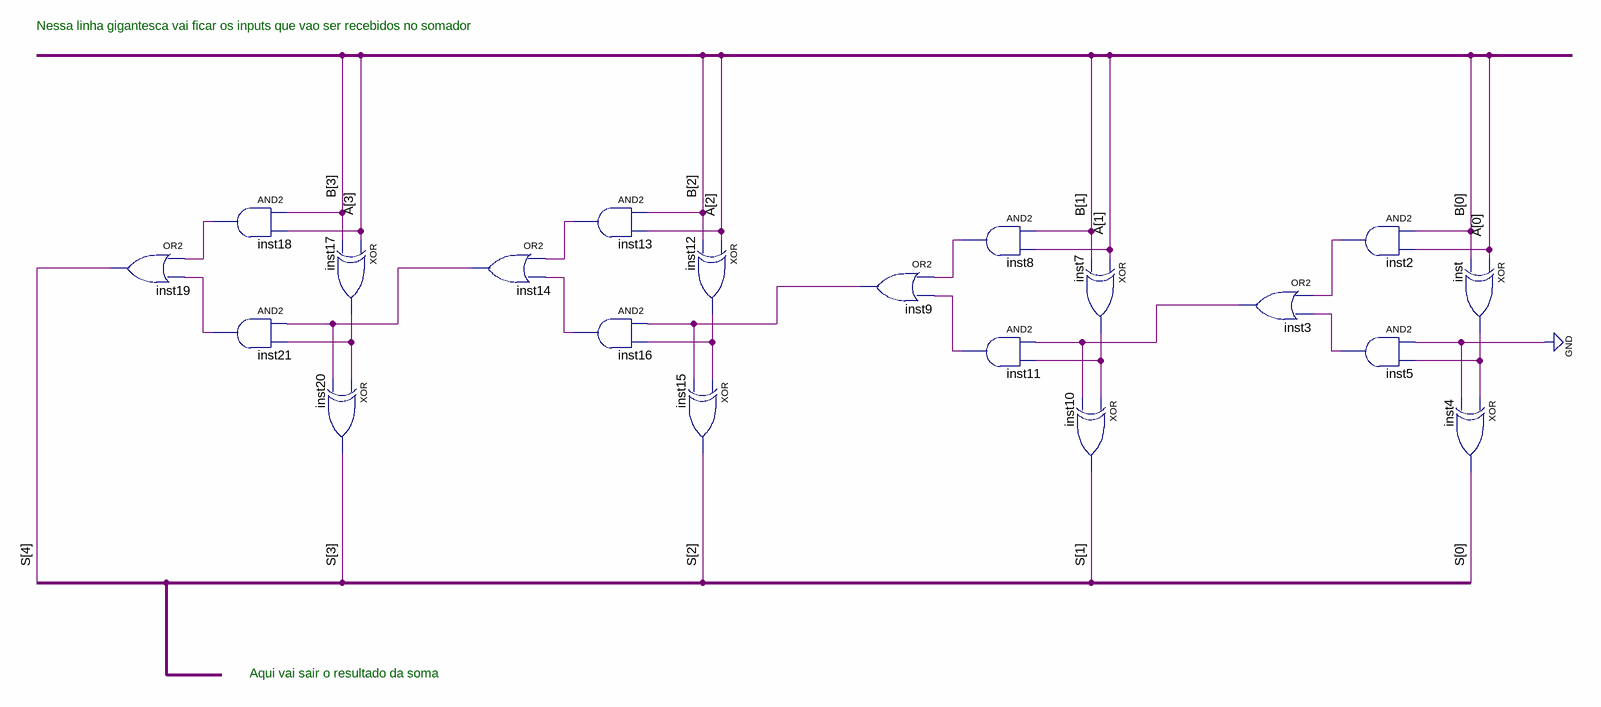
[diagram p0: schematic sheet]
// Quartus schematic eos_somadores.bdf as structural Verilog: 20 symbols, 0 pins
module eos_somadores (
);

  wire inst2_out, inst3_out, inst5_out, inst7_out, inst8_out, inst9_out, inst11_out, inst12_out, inst13_out,
       inst14_out, inst16_out, inst17_out, inst18_out, inst21_out, inst_out;
  wire [3:0] A, B;
  wire [4:0] S;

  or inst19 (S[4], inst18_out, inst21_out);
  and inst18 (inst18_out, B[3], A[3]);
  and inst21 (inst21_out, inst14_out, inst17_out);
  xor inst17 (inst17_out, A[3], B[3]);
  xor inst20 (S[3], inst17_out, inst14_out);
  or inst14 (inst14_out, inst13_out, inst16_out);
  and inst13 (inst13_out, B[2], A[2]);
  and inst16 (inst16_out, inst9_out, inst12_out);
  xor inst12 (inst12_out, A[2], B[2]);
  xor inst15 (S[2], inst12_out, inst9_out);
  or inst9 (inst9_out, inst8_out, inst11_out);
  and inst8 (inst8_out, B[1], A[1]);
  and inst11 (inst11_out, inst3_out, inst7_out);
  xor inst7 (inst7_out, A[1], B[1]);
  xor inst10 (S[1], inst7_out, inst3_out);
  or inst3 (inst3_out, inst2_out, inst5_out);
  and inst2 (inst2_out, B[0], A[0]);
  and inst5 (inst5_out, 1'b0, inst_out);
  xor inst4 (S[0], inst_out, 1'b0);
  xor inst (inst_out, A[0], B[0]);

  // Notes on the sheet:
  //   Nessa linha gigantesca vai ficar os inputs que vao ser recebidos no somador
  //   Aqui vai sair o resultado da soma
endmodule
